# Altium project thymio2-main.PrjPCB (part 2 of 2)

## Sheet LEDs.SchDoc: Thymio2
size A3; Engineer: Michael Bonani; Organization: Original design LSRO-STI-EPFL; Address1: Association Mobsya; Address2: Michael Bonani; Address3: Ch. Closel 3; Address4: CH-1020 Renens; DocumentNumber: 6; Revision: 2.3; SheetNumber: 6; SheetTotal: 9; Title2: PCB principal
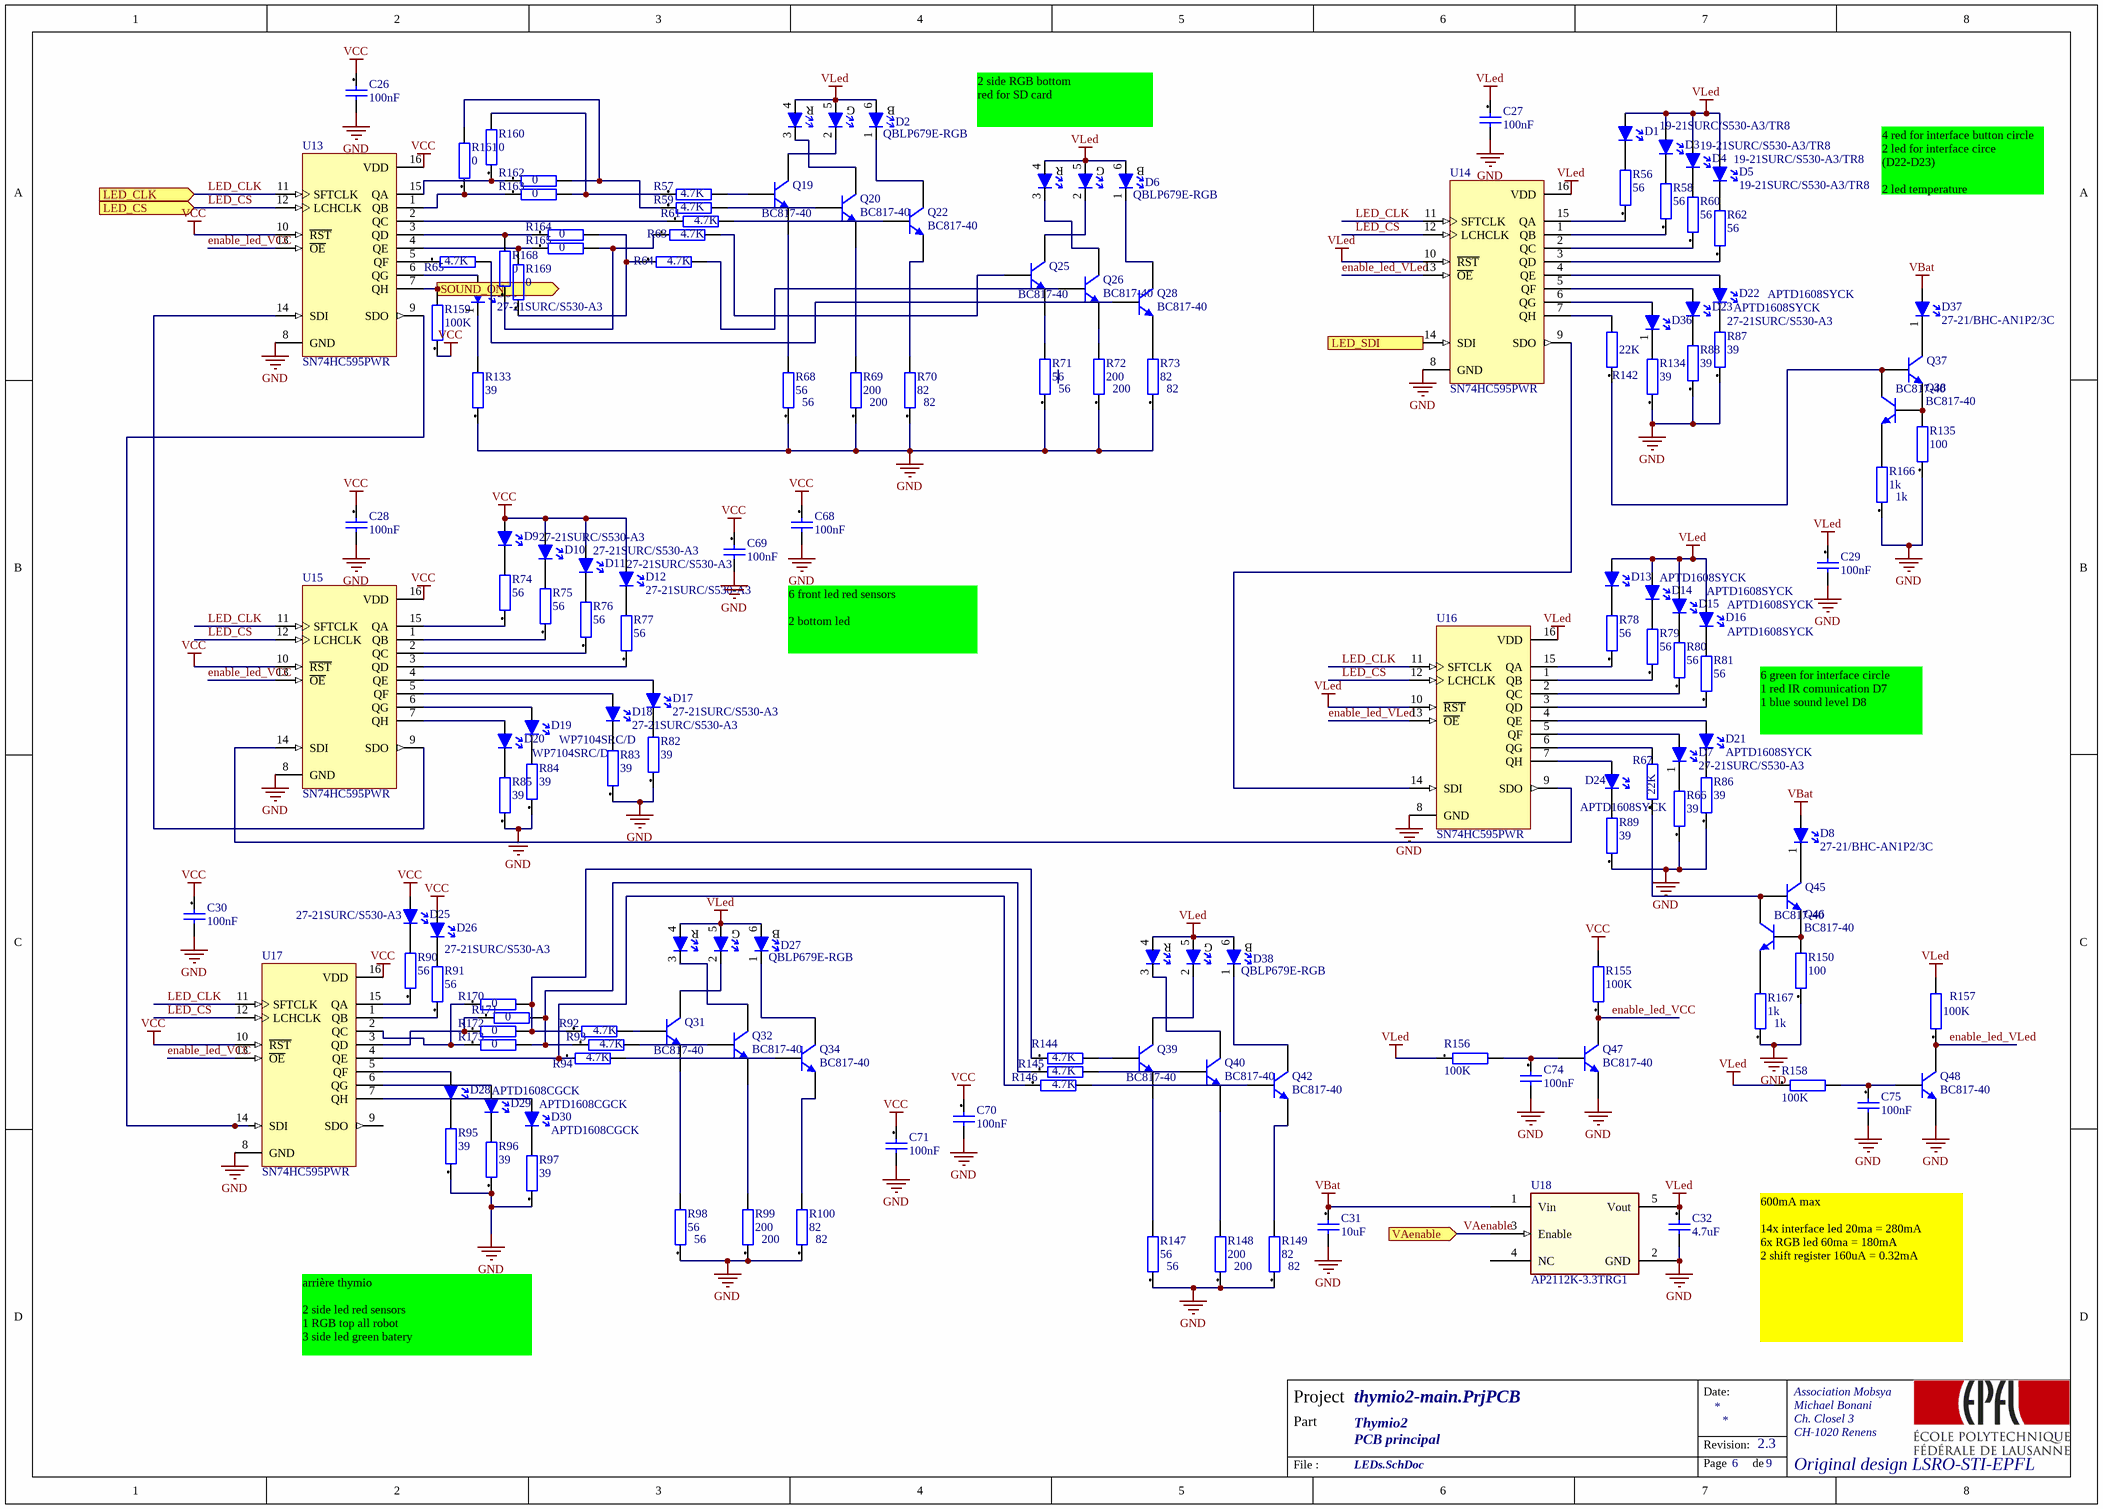
[diagram p5: LEDs.SchDoc]

### Parts
C26  100nF  [CAPC1005X05N]
C27  100nF  [CAPC1005X05N]
C28  100nF  [CAPC1005X05N]
C29  100nF  [CAPC1005X05N]
C30  100nF  [CAPC1005X05N]
C31  10uF  [CAPC1005X05N]
C32  4.7uF  [CAPC1005X05N]
C68  100nF  [CAPC1005X05N]
C69  100nF  [CAPC1005X05N]
C70  100nF  [CAPC1005X05N]
C71  100nF  [CAPC1005X05N]
C74  100nF  [CAPC1005X05N]
C75  100nF  [CAPC1005X05N]
D1  19-21SURC/S530-A3/TR8  [DIOC1608X08N]
D2  QBLP679E-RGB  [QBLP679E-RGB]
D3  19-21SURC/S530-A3/TR8  [DIOC1608X08N]
D4  19-21SURC/S530-A3/TR8  [DIOC1608X08N]
D5  19-21SURC/S530-A3/TR8  [DIOC1608X08N]
D6  QBLP679E-RGB  [QBLP679E-RGB]
D7  27-21SURC/S530-A3  [27-21 Everlight]
D8  27-21/BHC-AN1P2/3C  [27-21 Everlight Blue]
D9  27-21SURC/S530-A3  [27-21 Everlight]
D10  27-21SURC/S530-A3  [27-21 Everlight]
D11  27-21SURC/S530-A3  [27-21 Everlight]
D12  27-21SURC/S530-A3  [27-21 Everlight]
D13  APTD1608SYCK  [DIOC1608X08N]
D14  APTD1608SYCK  [DIOC1608X08N]
D15  APTD1608SYCK  [DIOC1608X08N]
D16  APTD1608SYCK  [DIOC1608X08N]
D17  27-21SURC/S530-A3  [27-21 Everlight]
D18  27-21SURC/S530-A3  [27-21 Everlight]
D19  WP7104SRC/D  [Led_TH_3mm_20mm]
D20  WP7104SRC/D  [Led_TH_3mm_20mm]
D21  APTD1608SYCK  [DIOC1608X08N]
D22  APTD1608SYCK  [DIOC1608X08N]
D23  APTD1608SYCK  [DIOC1608X08N]
D24  APTD1608SYCK  [DIOC1608X08N]
D25  27-21SURC/S530-A3  [27-21 Everlight]
D26  27-21SURC/S530-A3  [27-21 Everlight]
D27  QBLP679E-RGB  [QBLP679E-RGB]
D28  APTD1608CGCK  [DIOC1608X08N]
D29  APTD1608CGCK  [DIOC1608X08N]
D30  APTD1608CGCK  [DIOC1608X08N]
D35  27-21SURC/S530-A3  [27-21 Everlight]
D36  27-21SURC/S530-A3  [27-21 Everlight]
D37  27-21/BHC-AN1P2/3C  [27-21 Everlight Blue]
D38  QBLP679E-RGB  [QBLP679E-RGB]
Q19  BC817-40  [SOT23_N]
Q20  BC817-40  [SOT23_N]
Q22  BC817-40  [SOT23_N]
Q25  BC817-40  [SOT23_N]
Q26  BC817-40  [SOT23_N]
Q28  BC817-40  [SOT23_N]
Q31  BC817-40  [SOT23_N]
Q32  BC817-40  [SOT23_N]
Q34  BC817-40  [SOT23_N]
Q37  BC817-40  [SOT23_N]
Q38  BC817-40  [SOT23_N]
Q39  BC817-40  [SOT23_N]
Q40  BC817-40  [SOT23_N]
Q42  BC817-40  [SOT23_N]
Q45  BC817-40  [SOT23_N]
Q46  BC817-40  [SOT23_N]
Q47  BC817-40  [SOT23_N]
Q48  BC817-40  [SOT23_N]
R56  56  [RESC1005X04N]
R57  4.7K  [RESC1005X04N]
R58  56  [RESC1005X04N]
R59  4.7K  [RESC1005X04N]
R60  56  [RESC1005X04N]
R61  4.7K  [RESC1005X04N]
R62  56  [RESC1005X04N]
R63  4.7K  [RESC1005X04N]
R64  4.7K  [RESC1005X04N]
R65  4.7K  [RESC1005X04N]
R66  39  [RESC1005X04N]
R67  22K  [RESC1005X04N]
R68  56  [RESC1005X04N]
R69  200  [RESC1005X04N]
R70  82  [RESC1005X04N]
R71  56  [RESC1005X04N]
R72  200  [RESC1005X04N]
R73  82  [RESC1005X04N]
R74  56  [RESC1005X04N]
R75  56  [RESC1005X04N]
R76  56  [RESC1005X04N]
R77  56  [RESC1005X04N]
R78  56  [RESC1005X04N]
R79  56  [RESC1005X04N]
R80  56  [RESC1005X04N]
R81  56  [RESC1005X04N]
R82  39  [RESC1005X04N]
R83  39  [RESC1005X04N]
R84  39  [RESC1005X04N]
R85  39  [RESC1005X04N]
R86  39  [RESC1005X04N]
R87  39  [RESC1005X04N]
R88  39  [RESC1005X04N]
R89  39  [RESC1005X04N]
R90  56  [RESC1005X04N]
R91  56  [RESC1005X04N]
R92  4.7K  [RESC1005X04N]
R93  4.7K  [RESC1005X04N]
R94  4.7K  [RESC1005X04N]
R95  39  [RESC1005X04N]
R96  39  [RESC1005X04N]
R97  39  [RESC1005X04N]
R98  56  [RESC1005X04N]
R99  200  [RESC1005X04N]
R100  82  [RESC1005X04N]
R133  39  [RESC1005X04N]
R134  39  [RESC1005X04N]
R135  100  [RESC1005X04N]
R142  22K  [RESC1005X04N]
R144  4.7K  [RESC1005X04N]
R145  4.7K  [RESC1005X04N]
R146  4.7K  [RESC1005X04N]
R147  56  [RESC1005X04N]
R148  200  [RESC1005X04N]
R149  82  [RESC1005X04N]
R150  100  [RESC1005X04N]
R155  100K  [RESC1005X04N]
R156  100K  [RESC1005X04N]
R157  100K  [RESC1005X04N]
R158  100K  [RESC1005X04N]
R159  100K  [RESC1005X04N]
R160  0  [RESC1005X04N]
R161  0  [RESC1005X04N]
R162  0  [RESC1005X04N]
R163  0  [RESC1005X04N]
R164  0  [RESC1005X04N]
R165  0  [RESC1005X04N]
R166  1k  [RESC1005X04N]
R167  1k  [RESC1005X04N]
R168  0  [RESC1005X04N]
R169  0  [RESC1005X04N]
R170  0  [RESC1005X04N]
R171  0  [RESC1005X04N]
R172  0  [RESC1005X04N]
R173  0  [RESC1005X04N]
U13  SN74HC595PWR  [948F-01_N]
U14  SN74HC595PWR  [948F-01_N]
U15  SN74HC595PWR  [948F-01_N]
U16  SN74HC595PWR  [948F-01_N]
U17  SN74HC595PWR  [948F-01_N]
U18  AP2112K-3.3TRG1  [SOT95P285X100-5N]

### Ports
LED_CLK (in), LED_CS (in), LED_SDI (in), SOUND_ON (out), VAenable (in)

### Nets
GND: C26.2 C27.2 C28.2 C29.2 C30.2 C31.2 C32.2 C68.2 C69.2 C70.2 C71.2 C74.2 C75.2 Q47.2(E) Q48.2(E) R66.1 R68.1 R69.1 R70.1 R71.1 R72.1 R73.1 R82.1 R83.1 R84.1 R85.1 R86.1 R87.1 R88.1 R89.1 R95.1 R96.1 R97.1 R98.1 R99.1 R100.1 R133.1 R134.1 R135.1 R147.1 R148.1 R149.1 R150.1 R166.1 R167.1 U13.8(GND) U14.8(GND) U15.8(GND) U16.8(GND) U17.8(GND) U18.2(GND)
VBat: C31.1 D8.2(A) D37.2(A) U18.1(Vin)
VCC: C26.1 C28.1 C30.1 C68.1 C69.1 C70.1 C71.1 D9.2(A) D10.2(A) D11.2(A) D12.2(A) D25.2(A) D26.2(A) R155.2 R159.1 U13.10(~{RST}) U13.16(VDD) U15.10(~{RST}) U15.16(VDD) U17.10(~{RST}) U17.16(VDD)
VLed: C27.1 C29.1 C32.1 D1.2(A) D2.4(Ar) D2.5(Ag) D2.6(Ab) D3.2(A) D4.2(A) D5.2(A) D6.4(Ar) D6.5(Ag) D6.6(Ab) D13.2(A) D14.2(A) D15.2(A) D16.2(A) D27.4(Ar) D27.5(Ag) D27.6(Ab) D38.4(Ar) D38.5(Ag) D38.6(Ab) R156.1 R157.2 R158.1 U14.10(~{RST}) U14.16(VDD) U16.10(~{RST}) U16.16(VDD) U18.5(Vout)
enable_led_VCC: Q47.3(C) R155.1 U13.13(~{OE}) U15.13(~{OE}) U17.13(~{OE})
enable_led_VLed: Q48.3(C) R157.1 U14.13(~{OE}) U16.13(~{OE})
LED_CLK: U13.11(SFTCLK) U14.11(SFTCLK) U15.11(SFTCLK) U16.11(SFTCLK) U17.11(SFTCLK) ; port LED_CLK
LED_CS: U13.12(LCHCLK) U14.12(LCHCLK) U15.12(LCHCLK) U16.12(LCHCLK) U17.12(LCHCLK) ; port LED_CS
LED_SDI: U14.14(SDI) ; port LED_SDI
SOUND_ON: R159.2 U13.7(QH) ; port SOUND_ON
VAenable: U18.3(Enable) ; port VAenable
NetC74_1: C74.1 Q47.1(B) R156.2
NetC75_1: C75.1 Q48.1(B) R158.2
NetD1_1: D1.1(K) R56.2
NetD2_1: D2.1(Kb) Q22.3(C)
NetD2_2: D2.2(Kg) Q19.3(C)
NetD2_3: D2.3(Kr) Q20.3(C)
NetD3_1: D3.1(K) R58.2
NetD4_1: D4.1(K) R60.2
NetD5_1: D5.1(K) R62.2
NetD6_1: D6.1(Kb) Q28.3(C)
NetD6_2: D6.2(Kg) Q25.3(C)
NetD6_3: D6.3(Kr) Q26.3(C)
NetD7_1: D7.1(K) R66.2
NetD7_2: D7.2(A) U16.5(QF)
NetD8_1: D8.1(K) Q45.3(C)
NetD9_1: D9.1(K) R74.2
NetD10_1: D10.1(K) R75.2
NetD11_1: D11.1(K) R76.2
NetD12_1: D12.1(K) R77.2
NetD13_1: D13.1(K) R78.2
NetD14_1: D14.1(K) R79.2
NetD15_1: D15.1(K) R80.2
NetD16_1: D16.1(K) R81.2
NetD17_1: D17.1(K) R82.2
NetD17_2: D17.2(A) U15.4(QE)
NetD18_1: D18.1(K) R83.2
NetD18_2: D18.2(A) U15.5(QF)
NetD19_1: D19.1(K) R84.2
NetD19_2: D19.2(A) U15.6(QG)
NetD20_1: D20.1(K) R85.2
NetD20_2: D20.2(A) U15.7(QH)
NetD21_1: D21.1(K) R86.2
NetD21_2: D21.2(A) U16.4(QE)
NetD22_1: D22.1(K) R87.2
NetD22_2: D22.2(A) U14.4(QE)
NetD23_1: D23.1(K) R88.2
NetD23_2: D23.2(A) U14.5(QF)
NetD24_1: D24.1(K) R89.2
NetD24_2: D24.2(A) U16.7(QH)
NetD25_1: D25.1(K) R90.2
NetD26_1: D26.1(K) R91.2
NetD27_1: D27.1(Kb) Q34.3(C)
NetD27_2: D27.2(Kg) Q31.3(C)
NetD27_3: D27.3(Kr) Q32.3(C)
NetD28_1: D28.1(K) R95.2
NetD28_2: D28.2(A) U17.5(QF)
NetD29_1: D29.1(K) R96.2
NetD29_2: D29.2(A) U17.6(QG)
NetD30_1: D30.1(K) R97.2
NetD30_2: D30.2(A) U17.7(QH)
NetD35_1: D35.1(K) R133.2
NetD35_2: D35.2(A) U13.6(QG)
NetD36_1: D36.1(K) R134.2
NetD36_2: D36.2(A) U14.6(QG)
NetD37_1: D37.1(K) Q37.3(C)
NetD38_1: D38.1(Kb) Q42.3(C)
NetD38_2: D38.2(Kg) Q39.3(C)
NetD38_3: D38.3(Kr) Q40.3(C)
NetQ19_1: Q19.1(B) R57.2
NetQ19_2: Q19.2(E) R68.2
NetQ20_1: Q20.1(B) R59.2
NetQ20_2: Q20.2(E) R69.2
NetQ22_1: Q22.1(B) R61.2
NetQ22_2: Q22.2(E) R70.2
NetQ25_1: Q25.1(B) R63.2
NetQ25_2: Q25.2(E) R71.2
NetQ26_1: Q26.1(B) R64.2
NetQ26_2: Q26.2(E) R72.2
NetQ28_1: Q28.1(B) R65.2
NetQ28_2: Q28.2(E) R73.2
NetQ31_1: Q31.1(B) R92.2
NetQ31_2: Q31.2(E) R98.2
NetQ32_1: Q32.1(B) R93.2
NetQ32_2: Q32.2(E) R99.2
NetQ34_1: Q34.1(B) R94.2
NetQ34_2: Q34.2(E) R100.2
NetQ37_1: Q37.1(B) Q38.3(C) R142.1
NetQ37_2: Q37.2(E) Q38.1(B) R135.2
NetQ38_2: Q38.2(E) R166.2
NetQ39_1: Q39.1(B) R144.2
NetQ39_2: Q39.2(E) R147.2
NetQ40_1: Q40.1(B) R145.2
NetQ40_2: Q40.2(E) R148.2
NetQ42_1: Q42.1(B) R146.2
NetQ42_2: Q42.2(E) R149.2
NetQ45_1: Q45.1(B) Q46.3(C) R67.1
NetQ45_2: Q45.2(E) Q46.1(B) R150.2
NetQ46_2: Q46.2(E) R167.2
NetR56_1: R56.1 U14.15(QA)
NetR57_1: R57.1 R160.2 R163.2
NetR58_1: R58.1 U14.1(QB)
NetR59_1: R59.1 R161.2 R162.2
NetR60_1: R60.1 U14.2(QC)
NetR61_1: R61.1 U13.2(QC)
NetR62_1: R62.1 U14.3(QD)
NetR63_1: R63.1 R165.2 R168.1
NetR64_1: R64.1 R164.2 R169.1
NetR65_1: R65.1 U13.5(QF)
NetR67_2: R67.2 U16.6(QG)
NetR74_1: R74.1 U15.15(QA)
NetR75_1: R75.1 U15.1(QB)
NetR76_1: R76.1 U15.2(QC)
NetR77_1: R77.1 U15.3(QD)
NetR78_1: R78.1 U16.15(QA)
NetR79_1: R79.1 U16.1(QB)
NetR80_1: R80.1 U16.2(QC)
NetR81_1: R81.1 U16.3(QD)
NetR90_1: R90.1 U17.15(QA)
NetR91_1: R91.1 U17.1(QB)
NetR92_1: R92.1 R144.1 R170.2 R172.2
NetR93_1: R93.1 R145.1 R171.2 R173.2
NetR94_1: R94.1 R146.1 U17.4(QE)
NetR142_2: R142.2 U14.7(QH)
NetR160_1: R160.1 R162.1 U13.15(QA)
NetR161_1: R161.1 R163.1 U13.1(QB)
NetR164_1: R164.1 R168.2 U13.3(QD)
NetR165_1: R165.1 R169.2 U13.4(QE)
NetR170_1: R170.1 R173.1 U17.2(QC)
NetR171_1: R171.1 R172.1 U17.3(QD)
NetU13_9: U13.9(SDO) U17.14(SDI)
NetU13_14: U13.14(SDI) U15.9(SDO)
NetU14_9: U14.9(SDO) U16.14(SDI)
NetU15_14: U15.14(SDI) U16.9(SDO)

Not connected (* = marked no-connect by the designer): U17 9(SDO); U18 4(NC)

### Notes on the sheet
- (near D6) 2 side RGB bottom
  red for SD card
- 4 red for interface button circle
  2 led for interface circe (D22-D23)
  2 led temperature
- 6 front led red sensors
  2 bottom led
- 6 green for interface circle
  1 red IR comunication D7
  1 blue sound level D8
- arrière thymio
  2 side led red sensors
  1 RGB top all robot
  3 side led green batery
- 600mA max
  14x interface led 20ma = 280mA
  6x RGB led 60ma = 180mA
  2 shift register 160uA = 0.32mA
- Date:
- Project
- Part
- Revision:
- File :
- Page
- de
- (in symbol LED RGB SMD 2) R; G; B

### Library data of the parts
C26 C28 C30 C68-C71 C74 C75 = 100nF[[/\]]0603[[/\]]1: as C5 on sheet IR-sensors; Size: 0603; Footprint Acort: 0603_G; Supplier: Farnell; Supplier Nr: 1288255; ComponentLink2Description: Farnell link; ComponentLink2URL: http://ch.farnell.com/jsp/displayProduct.jsp?sku=1288255; Price_1: 0.046; Price_2: 0.04; Price_3: 0.037; Price_4: 0.036; ROHS: True; DateLastUpdate: 2007-12-03 / 14:22:31
C27 C29 = 100nF[[/\]]0603[[/\]]1: Capacitor; Manufacturer: Kemet; Manufacturer Nr: C0603C104K5RAC; Preference: 1; Tolerance +: +10; Tolerance -: -10; Dielectric: X7R; Voltage: 50; MaxTemperature: +125; MinTemperature: -55; Quant_1: 10; Quant_2: 100; Quant_3: 1000; Quant_4: 4000; Currentie: CHF; LayerSch: Top; Size: 0603; Footprint Acort: 0603_G; Supplier: Farnell; Supplier Nr: 1288255; ComponentLink2Description: Farnell link; ComponentLink2URL: http://ch.farnell.com/jsp/displayProduct.jsp?sku=1288255; Price_1: 0.046; Price_2: 0.04; Price_3: 0.037; Price_4: 0.036; ROHS: True; DateLastUpdate: 2007-12-03 / 14:22:31
C31 C32 = 4.7uF[[/\]]0603[[/\]]1: as C44 on sheet USB-power; Size: 0603; Footprint Acort: 0603_G; Supplier: Farnell; Supplier Nr: 9227784; ComponentLink2Description: Farnell link; ComponentLink2URL: http://ch.farnell.com/jsp/displayProduct.jsp?sku=9227784; Price_1: 0.33; Price_2: 0.298; Price_3: 0.278; Price_4: 0.246; ROHS: True; DateLastUpdate: 2007-12-03 / 14:22:57
D1 D3-D5 = LED: SMD Red 0603 2V@20ma 56 mcd; VerifiedComment: ToDo; LayerSch: Top
D2 D6 D27 D38 = LED RGB SMD 2: =Value: HBMGFRT825; VerifiedComment: ToDo; LayerSch: Top
D7 D36 = LED: SMD Red led right angle mount 2V@20ma 57mcd; VerifiedComment: ToDo; LayerSch: Top
D8 D37 = LED: SMD Blue led right angle mount 3.3V@20ma 28mcd; VerifiedComment: ToDo; LayerSch: Top
D9-D12 D17 D18 D25 D26 D35 = LED: SMD Red led right angle mount 2V@20ma 57mcd; VerifiedComment: ToDo
D13-D16 D21-D24 = LED: LED standard - CMS Helios SMD Yellow 590nm 480mcd; VerifiedComment: ToDo; LayerSch: Top
D19 D20 = LED: Red led 2V@20ma 57mcd; VerifiedComment: ToDo
D28-D30 = LED: LED standard - CMS Helios SMD Green 570nm 230mcd; VerifiedComment: ToDo; LayerSch: Top
Q19 Q20 Q22 Q25 Q26 Q28 = BC817-40: NPN General-purpose Transistor; Published: 17-Sep-2003; LatestRevisionDate: 12-Dec-2006; LatestRevisionNote: IPC-7351 Footprint Added.; DatasheetVersion: Jun-1999; PackageVersion: May-1999; PackageReference: SOT23; Publisher: Altium Limited; PackageDescription: 3-Pin SOT-23 Package 0.95 mm Pitch, 2.3 mm Lead Span; ComponentLink1Description: Manufacturer Link; ComponentLink1URL: http://www.semiconductors.philips.com/; ComponentLink2Description: Datasheet; ComponentLink2URL: http://www.semiconductors.philips.com/acrobat/datasheets/BC817_BC817W_BC337_5.pdf
Q31 Q32 Q34 Q37-Q40 Q42 Q45-Q48 = BC817-40: NPN General-purpose Transistor; LayerSch: Top; Published: 17-Sep-2003; LatestRevisionDate: 12-Dec-2006; LatestRevisionNote: IPC-7351 Footprint Added.; DatasheetVersion: Jun-1999; PackageVersion: May-1999; PackageReference: SOT23; Publisher: Altium Limited; PackageDescription: 3-Pin SOT-23 Package 0.95 mm Pitch, 2.3 mm Lead Span; ComponentLink1Description: Manufacturer Link; ComponentLink1URL: http://www.semiconductors.philips.com/; ComponentLink2Description: Datasheet; ComponentLink2URL: http://www.semiconductors.philips.com/acrobat/datasheets/BC817_BC817W_BC337_5.pdf
R56 R58 R60 R62 R66 R78-R81 R86-R89 R134 = 68K[[/\]]0603[[/\]]1: Resistor; Manufacturer: Vishay; Manufacturer Nr: D11CRCW06030B6802F; Tolerance: +/-1; Preference: 1; Power: 0.1; Voltage: 75; Current: 1.5; ppm/K: +/-100; Quant_1: 10; Quant_2: 100; Quant_3: 500; Currentie: CHF; LayerSch: Top; Size: 0603; Footprint Acort: 0603; Supplier: Distrelec; Supplier Nr: 715632; ComponentLink2Description: Distrelec link; ComponentLink2URL: http://www.distrelec.com/ishopWebFront/search/luceneSearch.do?dispatch=find&showImage=on&artnrPhrase=715632; ROHS: True; Price_1: 0.0538; Price_2: 0.0323; Price_3: 0.0204; DateLastUpdate: 2007-12-03 / 16:30:21
R57 R59 R61 R63-R65 = 4.7K[[/\]]0603[[/\]]1: Resistor; Manufacturer: Vishay; Manufacturer Nr: D11CRCW06030B4701F; Tolerance: +/-1; Preference: 1; Power: 0.1; Voltage: 75; Current: 1.5; ppm/K: +/-100; Quant_1: 10; Quant_2: 100; Quant_3: 500; Currentie: CHF; Size: 0603; Footprint Acort: 0603; Supplier: Distrelec; Supplier Nr: 715604; ComponentLink2Description: Distrelec link; ComponentLink2URL: http://www.distrelec.com/ishopWebFront/search/luceneSearch.do?dispatch=find&showImage=on&artnrPhrase=715604; ROHS: True; Price_1: 0.0538; Price_2: 0.0323; Price_3: 0.0204; DateLastUpdate: 2007-12-03 / 16:30:20
R67 R92-R94 R142 R144-R146 R155-R165 R168-R173 = 4.7K[[/\]]0603[[/\]]1: Resistor; Manufacturer: Vishay; Manufacturer Nr: D11CRCW06030B4701F; Tolerance: +/-1; Preference: 1; Power: 0.1; Voltage: 75; Current: 1.5; ppm/K: +/-100; Quant_1: 10; Quant_2: 100; Quant_3: 500; Currentie: CHF; LayerSch: Top; Size: 0603; Footprint Acort: 0603; Supplier: Distrelec; Supplier Nr: 715604; ComponentLink2Description: Distrelec link; ComponentLink2URL: http://www.distrelec.com/ishopWebFront/search/luceneSearch.do?dispatch=find&showImage=on&artnrPhrase=715604; ROHS: True; Price_1: 0.0538; Price_2: 0.0323; Price_3: 0.0204; DateLastUpdate: 2007-12-03 / 16:30:20
R68-R73 = RES
  R68 R71: Value: 56
  R69 R72: Value: 200
  R70 R73: Value: 82
R74-R77 R82-R85 R90 R91 R95-R97 R133 = 68K[[/\]]0603[[/\]]1: Resistor; Manufacturer: Vishay; Manufacturer Nr: D11CRCW06030B6802F; Tolerance: +/-1; Preference: 1; Power: 0.1; Voltage: 75; Current: 1.5; ppm/K: +/-100; Quant_1: 10; Quant_2: 100; Quant_3: 500; Currentie: CHF; Size: 0603; Footprint Acort: 0603; Supplier: Distrelec; Supplier Nr: 715632; ComponentLink2Description: Distrelec link; ComponentLink2URL: http://www.distrelec.com/ishopWebFront/search/luceneSearch.do?dispatch=find&showImage=on&artnrPhrase=715632; ROHS: True; Price_1: 0.0538; Price_2: 0.0323; Price_3: 0.0204; DateLastUpdate: 2007-12-03 / 16:30:21
R98-R100 R147-R149 = RES: LayerSch: Top
  R98 R147: Value: 56
  R99 R148: Value: 200
  R100 R149: Value: 82
R135 R150 = 68K[[/\]]0603[[/\]]1: Resistor; Manufacturer: Vishay; Manufacturer Nr: D11CRCW06030B6802F; Tolerance: +/-1; Preference: 1; Power: 0.1; Voltage: 75; Current: 1.5; ppm/K: +/-100; Quant_1: 10; Quant_3: 500; Currentie: CHF; LayerSch: Top; Size: 0603; Footprint Acort: 0603; Supplier: Distrelec; Supplier Nr: 715632; ComponentLink2Description: Distrelec link; ComponentLink2URL: http://www.distrelec.com/ishopWebFront/search/luceneSearch.do?dispatch=find&showImage=on&artnrPhrase=715632; ROHS: True; Price_1: 0.0538; Quant_2: 100; Price_2: 0.0323; Price_3: 0.0204; DateLastUpdate: 2007-12-03 / 16:30:21
R166 R167 = RES: 120; Value: 1k
U13 U15 U17 = MC74HC595ADTR2: 8-Bit Serial-Input/Serial or Prallel-Output Shift Register with Latched 3-State Outputs; Published: 15-Apr-2002; LatestRevisionDate: 12-Dec-2006; LatestRevisionNote: IPC-7351 Footprint Added.; DatasheetVersion: Mar-2000; PackageVersion: Feb-2000; PackageReference: 948F-01; Publisher: Altium Limited; PackageDescription: 16-Pin Thin Small Outline Package 0.65 mm Pitch; ComponentLink1Description: Manufacturer Link; ComponentLink1URL: http://www.onsemi.com/; ComponentLink2Description: Datasheet; ComponentLink2URL: http://www.onsemi.com/pub/Collateral/MC74HC595A-D.PDF
U14 U16 = MC74HC595ADTR2: 8-Bit Serial-Input/Serial or Prallel-Output Shift Register with Latched 3-State Outputs; LayerSch: Top; Published: 15-Apr-2002; LatestRevisionDate: 12-Dec-2006; LatestRevisionNote: IPC-7351 Footprint Added.; DatasheetVersion: Mar-2000; PackageVersion: Feb-2000; PackageReference: 948F-01; Publisher: Altium Limited; PackageDescription: 16-Pin Thin Small Outline Package 0.65 mm Pitch; ComponentLink1Description: Manufacturer Link; ComponentLink1URL: http://www.onsemi.com/; ComponentLink2Description: Datasheet; ComponentLink2URL: http://www.onsemi.com/pub/Collateral/MC74HC595A-D.PDF
U18 = AP7331: as U22 on sheet USB-power

## Sheet motor.SchDoc: Thymio2
size A4; Organization: Original design LSRO-STI-EPFL; Address1: Association Mobsya; Address2: Michael Bonani; Address3: Ch. Closel 3; Address4: CH-1020 Renens; DocumentNumber: 7; Revision: 2.3; SheetNumber: 7; SheetTotal: 9; Engineer: Michael Bonani; Title2: PCB principal; ProjectName: Name of the project
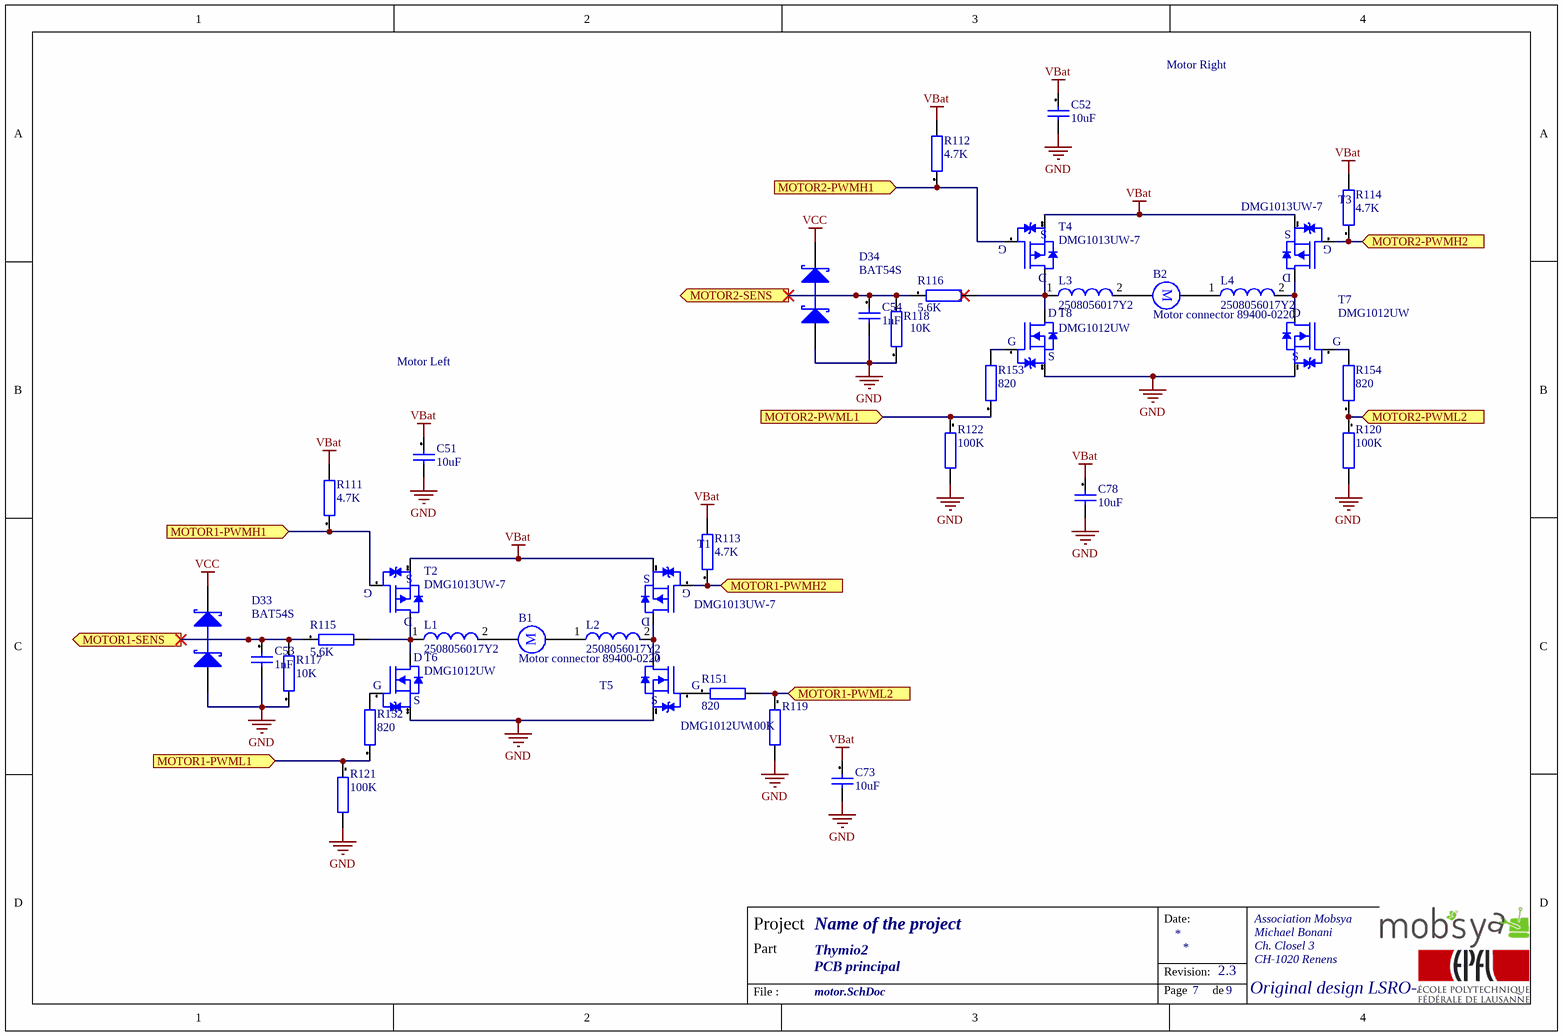
[diagram p6: motor.SchDoc]

### Parts
B1  Motor connector 89400-0220  [BAT-2]
B2  Motor connector 89400-0220  [BAT-2]
C51  10uF  [CAPC1005X05N]
C52  10uF  [CAPC1005X05N]
C53  1nF  [CAPC1005X05N]
C54  1nF  [CAPC1005X05N]
C73  10uF  [CAPC1005X05N]
C78  10uF  [CAPC1005X05N]
D33  BAT54S  [SOT23_N]
D34  BAT54S  [SOT23_N]
L1  2508056017Y2  [INDC2012X11L]
L2  2508056017Y2  [INDC2012X11L]
L3  2508056017Y2  [INDC2012X11L]
L4  2508056017Y2  [INDC2012X11L]
R111  4.7K  [RESC1005X04N]
R112  4.7K  [RESC1005X04N]
R113  4.7K  [RESC1005X04N]
R114  4.7K  [RESC1005X04N]
R115  5.6K  [RESC1005X04N]
R116  5.6K  [RESC1005X04N]
R117  10K  [RESC1005X04N]
R118  10K  [RESC1005X04N]
R119  100K  [RESC1005X04N]
R120  100K  [RESC1005X04N]
R121  100K  [RESC1005X04N]
R122  100K  [RESC1005X04N]
R151  820  [RESC1005X04N]
R152  820  [RESC1005X04N]
R153  820  [RESC1005X04N]
R154  820  [RESC1005X04N]
T1  DMG1013UW-7  [SOT65P210X100-3N]
T2  DMG1013UW-7  [SOT65P210X100-3N]
T3  DMG1013UW-7  [SOT65P210X100-3N]
T4  DMG1013UW-7  [SOT65P210X100-3N]
T5  DMG1012UW  [SOT65P210X100-3N]
T6  DMG1012UW  [SOT65P210X100-3N]
T7  DMG1012UW  [SOT65P210X100-3N]
T8  DMG1012UW  [SOT65P210X100-3N]

### Ports
MOTOR1-PWMH1 (in), MOTOR1-PWMH2 (in), MOTOR1-PWML1 (in), MOTOR1-PWML2 (in), MOTOR1-SENS (out), MOTOR2-PWMH1 (in), MOTOR2-PWMH2 (in), MOTOR2-PWML1 (in), MOTOR2-PWML2 (in), MOTOR2-SENS (out)

### Nets
GND: C51.2 C52.2 C53.2 C54.2 C73.2 C78.2 D33.1(A) D34.1(A) R117.1 R118.1 R119.2 R120.2 R121.2 R122.2 T5.2(S) T6.2(S) T7.2(S) T8.2(S)
VBat: C51.1 C52.1 C73.1 C78.1 R111.2 R112.2 R113.2 R114.2 T1.2(S) T2.2(S) T3.2(S) T4.2(S)
VCC: D33.2(K) D34.2(K)
MOTOR1-PWMH1: R111.1 T2.1(G) ; port MOTOR1-PWMH1
MOTOR1-PWMH2: R113.1 T1.1(G) ; port MOTOR1-PWMH2
MOTOR1-PWML1: R121.1 R152.1 ; port MOTOR1-PWML1
MOTOR1-PWML2: R119.1 R151.2 ; port MOTOR1-PWML2
MOTOR1-SENS: C53.1 D33.3(C) R115.1 R117.2 ; port MOTOR1-SENS
MOTOR2-PWMH1: R112.1 T4.1(G) ; port MOTOR2-PWMH1
MOTOR2-PWMH2: R114.1 T3.1(G) ; port MOTOR2-PWMH2
MOTOR2-PWML1: R122.1 R153.1 ; port MOTOR2-PWML1
MOTOR2-PWML2: R120.1 R154.1 ; port MOTOR2-PWML2
MOTOR2-SENS: C54.1 D34.3(C) R116.1 R118.2 ; port MOTOR2-SENS
NetB1_1: B1.1 L1.2
NetB1_2: B1.2 L2.1
NetB2_1: B2.1 L4.1
NetB2_2: B2.2 L3.2
NetL1_1: L1.1 R115.2 T2.3(D) T6.3(D)
NetL2_2: L2.2 T1.3(D) T5.3(D)
NetL3_1: L3.1 R116.2 T4.3(D) T8.3(D)
NetL4_2: L4.2 T3.3(D) T7.3(D)
NetR151_1: R151.1 T5.1(G)
NetR152_2: R152.2 T6.1(G)
NetR153_2: R153.2 T8.1(G)
NetR154_2: R154.2 T7.1(G)

### Notes on the sheet
- Motor Right
- Motor Left
- Date:
- Project
- Part
- Revision:
- File :
- Page
- de
- (in symbol Motor) M

### Library data of the parts
B1 B2 = Motor: Motor, General Kind; LayerSch: Top; Published: 24-Mar-1999; LatestRevisionDate: 17-Jul-2002; LatestRevisionNote: Re-released for DXP Platform.; PackageReference: RB5-10.5; Publisher: Altium Limited
C51 C52 C73 C78 = 10uF[[/\]]0603[[/\]]1: Capacitor; Manufacturer: Taiyo Yuden; Manufacturer Nr: JMK107BJ106MA-T; Preference: 1; Tolerance +: +15; Tolerance -: -15; Dielectric: X5R; Voltage: 6.3; MaxTemperature: +85; MinTemperature: -55; Quant_2: 100; Quant_3: 500; Currentie: CHF; Size: 0603; Footprint Acort: 0603_G; Supplier: Farnell; Supplier Nr: 1463375; ComponentLink2Description: Farnell link; ComponentLink2URL: http://ch.farnell.com/jsp/displayProduct.jsp?sku=1463375; Quant_1: 1; Price_1: 0.768; Price_2: 0.674; Price_3: 0.372; ROHS: True; DateLastUpdate: 2007-12-03 / 14:22:36
C53 C54 = 100nF[[/\]]0603[[/\]]1: as C27 on sheet LEDs; Size: 0603; Footprint Acort: 0603_G; Supplier: Farnell; Supplier Nr: 1288255; ComponentLink2Description: Farnell link; ComponentLink2URL: http://ch.farnell.com/jsp/displayProduct.jsp?sku=1288255; Price_1: 0.046; Price_2: 0.04; Price_3: 0.037; Price_4: 0.036; ROHS: True; DateLastUpdate: 2007-12-03 / 14:22:31
D33 D34 = BAT54S: Schottky Barrier Double Diode; LayerSch: Top; Published: 17-Sep-2003; LatestRevisionDate: 12-Dec-2006; LatestRevisionNote: IPC-7351 Footprint Added.; DatasheetVersion: 4-Mar-2002; PackageVersion: May-1999; PackageReference: SOT23; Publisher: Altium Limited; PackageDescription: 3-Pin SOT-23 Package 0.95 mm Pitch, 2.3 mm Lead Span; ComponentLink1Description: Manufacturer Link; ComponentLink1URL: http://www.semiconductors.philips.com/; ComponentLink2Description: Datasheet; ComponentLink2URL: http://www.semiconductors.philips.com/acrobat/datasheets/BAT54_SERIES_4.pdf
L1-L4 = 74279204: as L5 on sheet microcontroleur; PackageReference: SMD-0805; PackageDescription: Chip Inductor, 2-Leads, Body 2.0 x 1.2 mm; PartNumber: 2508056017Y2; ComponentLink1Description: Fair-Rite; ComponentLink2Description: https://www.mouser.ch/datasheet/2/150/2508056017Y2-472219.pdf
R111-R114 = 4.7K[[/\]]0603[[/\]]1: as R57 on sheet LEDs; Size: 0603; Footprint Acort: 0603; Supplier: Distrelec; Supplier Nr: 715604; ComponentLink2Description: Distrelec link; ComponentLink2URL: http://www.distrelec.com/ishopWebFront/search/luceneSearch.do?dispatch=find&showImage=on&artnrPhrase=715604; ROHS: True; Price_1: 0.0538; Price_2: 0.0323; Price_3: 0.0204; DateLastUpdate: 2007-12-03 / 16:30:20
R115 R116 = 2.2K[[/\]]0603[[/\]]1: Resistor; Manufacturer: Vishay; Manufacturer Nr: D11CRCW06030B2201F; Tolerance: +/-1; Preference: 1; Power: 0.1; Voltage: 75; Current: 1.5; ppm/K: +/-100; Quant_1: 10; Quant_2: 100; Quant_3: 500; Currentie: CHF; LayerSch: Top; Size: 0603; Footprint Acort: 0603; Supplier: Distrelec; Supplier Nr: 715596; ComponentLink2Description: Distrelec link; ComponentLink2URL: http://www.distrelec.com/ishopWebFront/search/luceneSearch.do?dispatch=find&showImage=on&artnrPhrase=715596; ROHS: True; Price_1: 0.085; Price_2: 0.0603; Price_3: 0.0247; DateLastUpdate: 2009-06-10 / 12:36:43
R117 R118 = 8.2K[[/\]]0603[[/\]]2: Resistor; Manufacturer: Multicomp; Manufacturer Nr: MC 0.063W 0603 1% 8K2; Tolerance: +/-1%; Preference: 2; Power: 0.063; Voltage: 50; Current: 1; ppm/K: +/-100; Quant_2: 250; Quant_3: 1000; Quant_4: 5000; Quant_5: 15000; Currentie: CHF; LayerSch: Top; Size: 0603; Footprint Acort: 0603; Supplier: Farnell; Supplier Nr: 9331565; ComponentLink2Description: Farnell link; ComponentLink2URL: http://ch.farnell.com/jsp/displayProduct.jsp?sku=9331565; ROHS: True; Quant_1: 50; Price_1: 0.062; Price_2: 0.049; Price_3: 0.038; Price_4: 0.027; Price_5: 0.021; DateLastUpdate: 2007-11-29 / 09:13:37
R119-R122 = 100K[[/\]]0603[[/\]]1: as R143 on sheet microcontroleur; Size: 0603; Footprint Acort: 0603; ComponentLink1Description: OnLine datasheet; Supplier: Distrelec; Supplier Nr: 715636; ComponentLink2Description: Distrelec link; ComponentLink2URL: http://www.distrelec.com/ishopWebFront/search/luceneSearch.do?dispatch=find&showImage=on&artnrPhrase=715636; ROHS: True; Price_1: 0.0538; Price_2: 0.0323; Price_3: 0.0204; DateLastUpdate: 2007-12-03 / 16:29:58
R151-R154 = 22K[[/\]]0603[[/\]]1: Resistor; Manufacturer: Vishay; Manufacturer Nr: D11CRCW06030B2202F; Tolerance: +/-1; Preference: 1; Power: 0.1; Voltage: 75; Current: 1.5; ppm/K: +/-100; Quant_1: 10; Quant_2: 100; Quant_3: 500; Currentie: CHF; LayerSch: Top; Size: 0603; Footprint Acort: 0603; Supplier: Distrelec; Supplier Nr: 715620; ComponentLink2Description: Distrelec link; ComponentLink2URL: http://www.distrelec.com/ishopWebFront/search/luceneSearch.do?dispatch=find&showImage=on&artnrPhrase=715620; ROHS: True; Price_1: 0.0538; Price_2: 0.0323; Price_3: 0.0204; DateLastUpdate: 2007-12-03 / 16:30:04
T1-T4 = DMG1013T: Transistor MOSFET 1 x P Pining : 1=G, 2=S, 3=D; VerifiedComment: Ok; VerifiedBy: DBR; VerifiedDate: 20071013
T5-T8 = DMG1012T: Transistor MOSFET 1 x N, Pining : 1=G, 2=S, 3=D; VerifiedComment: Ok; VerifiedBy: DBR; VerifiedDate: 20071013

## Sheet sound.SchDoc: Thymio2
size A4; Organization: Original design LSRO-STI-EPFL; Address1: Association Mobsya; Address2: Michael Bonani; Address3: Ch. Closel 3; Address4: CH-1020 Renens; DocumentNumber: 8; Revision: 2.3; SheetNumber: 8; SheetTotal: 9; Engineer: Michael Bonani; Title2: PCB principal; ProjectName: Name of the project
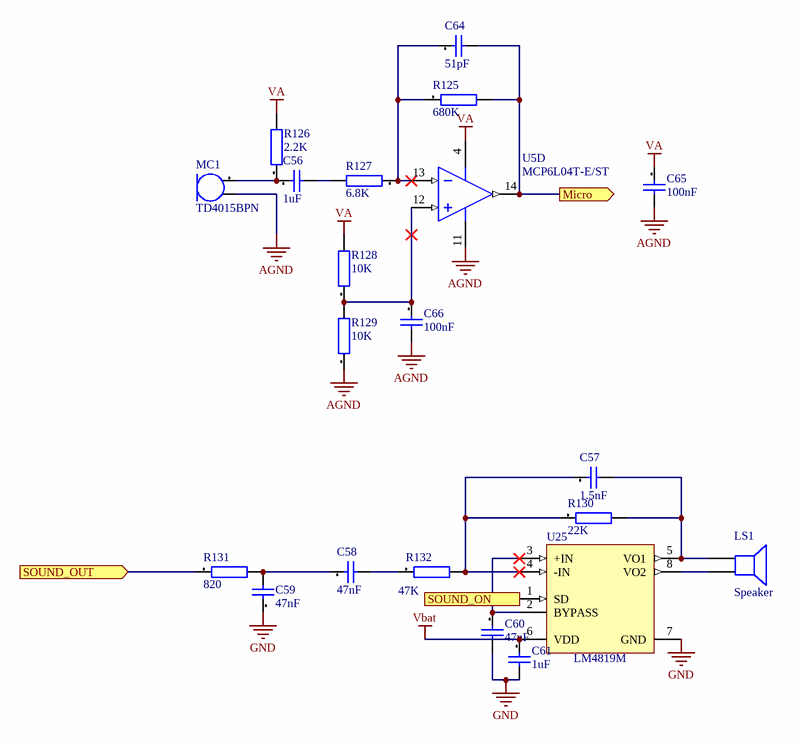
[diagram p7: sound.SchDoc]

### Parts
C56  1uF  [CAPC1005X05N]
C57  1.5nF  [CAPC1005X05N]
C58  47nF  [CAPC1005X05N]
C59  47nF  [CAPC1005X05N]
C60  47nF  [CAPC1005X05N]
C61  1uF  [CAPC1005X05N]
C64  51pF  [CAPC1005X05N]
C65  100nF  [CAPC1005X05N]
C66  100nF  [CAPC1005X05N]
LS1  Speaker  [PIN2]
MC1  TD4015BPN  [MICRO_TD4015BPN]
R125  680K  [RESC1005X04N]
R126  2.2K  [RESC1005X04N]
R127  6.8K  [RESC1005X04N]
R128  10K  [RESC1005X04N]
R129  10K  [RESC1005X04N]
R130  22K  [RESC1005X04N]
R131  820  [RESC1005X04N]
R132  47K  [RESC1005X04N]
U5  MCP6L04T-E/ST  [TSSOP-ST14_N]  (part D of 4)
U25  LM4819M  [M08A_N]

### Ports
Micro (out), SOUND_ON (in), SOUND_OUT (in)

### Nets
AGND: C65.2 C66.2 MC1.2 R129.1 U5.11(VSS)
GND: C59.1 C60.2 C61.2 U25.7(GND)
VA: C65.1 R126.2 R128.2 U5.4(VDD)
VBat: C61.1 U25.6(VDD)
Micro: C64.2 R125.2 U5.14(VOUTD) ; port Micro
SOUND_ON: U25.1(SD) ; port SOUND_ON
SOUND_OUT: R131.1 ; port SOUND_OUT
NetC56_1: C56.1 MC1.1 R126.1
NetC56_2: C56.2 R127.2
NetC57_1: C57.1 R130.1 R132.2 U25.4(-IN)
NetC57_2: C57.2 LS1.2 R130.2 U25.5(VO1)
NetC58_1: C58.1 C59.2 R131.2
NetC58_2: C58.2 R132.1
NetC60_1: C60.1 U25.2(BYPASS) U25.3(+IN)
NetC64_1: C64.1 R125.1 R127.1 U5.13(VIND-)
NetC66_1: C66.1 R128.1 R129.2 U5.12(VIND+)
NetLS1_1: LS1.1 U25.8(VO2)

### Notes on the sheet
- Date:
- Project
- Part
- Revision:
- File :
- Page
- de

### Library data of the parts
C56 = 4.7uF[[/\]]0603[[/\]]1: as C44 on sheet USB-power; Size: 0603; Footprint Acort: 0603_G; Supplier: Farnell; Supplier Nr: 9227784; ComponentLink2Description: Farnell link; ComponentLink2URL: http://ch.farnell.com/jsp/displayProduct.jsp?sku=9227784; Price_1: 0.33; Price_2: 0.298; Price_3: 0.278; Price_4: 0.246; ROHS: True; DateLastUpdate: 2007-12-03 / 14:22:57
C57 C59 C64 = 10nF[[/\]]0603[[/\]]1: Capacitor; Manufacturer: Multicomp; Manufacturer Nr: U0603R103KCT; Preference: 1; Tolerance +: +10; Tolerance -: -10; Dielectric: X7R; Voltage: 50; MaxTemperature: +125; MinTemperature: -55; Quant_1: 10; Quant_2: 100; Quant_3: 1000; Currentie: CHF; LayerSch: Top; Size: 0603; Footprint Acort: 0603_G; Supplier: Farnell; Supplier Nr: 9406182; ComponentLink2Description: Farnell link; ComponentLink2URL: http://ch.farnell.com/jsp/displayProduct.jsp?sku=9406182; Price_1: 0.062; Price_2: 0.041; Price_3: 0.021; ROHS: True; DateLastUpdate: 2007-12-03 / 14:22:34
C58 C60 = 470nF[[/\]]0603[[/\]]1: Capacitor; Manufacturer: Murata; Manufacturer Nr: GRM188R61C474K; Preference: 1; Tolerance +: +10; Tolerance -: -10; Dielectric: X5R; Voltage: 16; MaxTemperature: +85; MinTemperature: -55; Quant_1: 10; Quant_2: 100; Quant_3: 500; Currentie: CHF; LayerSch: Top; Size: 0603; Footprint Acort: 0603_G; Supplier: Distrelec; Supplier Nr: 823494; ComponentLink2Description: Distrelec link; ComponentLink2URL: http://www.distrelec.com/ishopWebFront/search/luceneSearch.do?dispatch=find&showImage=on&artnrPhrase=823494; Price_1: 0.1797; Price_2: 0.1474; Price_3: 0.1162; ROHS: True; DateLastUpdate: 2007-12-03 / 14:23:01
C61 = 1uF[[/\]]0603[[/\]]1: Capacitor; Manufacturer: Murata; Manufacturer Nr: GRM188R61E105K; Preference: 1; Tolerance +: +10; Tolerance -: -10; Dielectric: X5R; Voltage: 25; MaxTemperature: +85; MinTemperature: -55; Quant_1: 10; Quant_2: 100; Quant_3: 500; Currentie: CHF; LayerSch: Top; Size: 0603; Footprint Acort: 0603_G; Supplier: Distrelec; Supplier Nr: 823495; ComponentLink2Description: Distrelec link; ComponentLink2URL: http://www.distrelec.com/ishopWebFront/search/luceneSearch.do?dispatch=find&showImage=on&artnrPhrase=823495; Price_1: 0.1797; Price_2: 0.1474; Price_3: 0.1162; ROHS: True; DateLastUpdate: 2007-12-03 / 14:22:46
C65 C66 = 100nF[[/\]]0603[[/\]]1: as C27 on sheet LEDs; Size: 0603; Footprint Acort: 0603_G; Supplier: Farnell; Supplier Nr: 1288255; ComponentLink2Description: Farnell link; ComponentLink2URL: http://ch.farnell.com/jsp/displayProduct.jsp?sku=1288255; Price_1: 0.046; Price_2: 0.04; Price_3: 0.037; Price_4: 0.036; ROHS: True; DateLastUpdate: 2007-12-03 / 14:22:31
LS1 = Speaker: Loudspeaker; LayerSch: Top; Published: 24-Mar-1999; LatestRevisionDate: 17-Jul-2002; LatestRevisionNote: Re-released for DXP Platform.; PackageReference: PIN2; Publisher: Altium Limited
MC1 = Micro1: Omnidirectional Back Electret Condenser Microphone; LayerSch: Top
R125 = 470K[[/\]]0603[[/\]]1: Resistor; Manufacturer: Vishay; Manufacturer Nr: D11CRCW06030B4703F; Tolerance: +/-1; Preference: 1; Power: 0.1; Voltage: 75; Current: 1.5; ppm/K: +/-100; Quant_1: 10; Quant_2: 100; Quant_3: 500; Currentie: CHF; LayerSch: Top; Size: 0603; Footprint Acort: 0603; Supplier: Distrelec; Supplier Nr: 715652; ComponentLink2Description: Distrelec link; ComponentLink2URL: http://www.distrelec.com/ishopWebFront/search/luceneSearch.do?dispatch=find&showImage=on&artnrPhrase=715652; ROHS: True; Price_1: 0.0538; Price_2: 0.0323; Price_3: 0.0204; DateLastUpdate: 2007-12-03 / 16:30:19
R126 = 2.2K[[/\]]0603[[/\]]1: as R115 on sheet motor; Size: 0603; Footprint Acort: 0603; Supplier: Distrelec; Supplier Nr: 715596; ComponentLink2Description: Distrelec link; ComponentLink2URL: http://www.distrelec.com/ishopWebFront/search/luceneSearch.do?dispatch=find&showImage=on&artnrPhrase=715596; ROHS: True; Price_1: 0.085; Price_2: 0.0603; Price_3: 0.0247; DateLastUpdate: 2009-06-10 / 12:36:43
R127-R129 = 10K[[/\]]0603[[/\]]1: Resistor; Manufacturer: Vishay; Manufacturer Nr: D11CRCW06030B1002F; Tolerance: +/-1; Preference: 1; Power: 0.1; Voltage: 75; Current: 1.5; ppm/K: +/-100; Quant_1: 10; Quant_2: 100; Quant_3: 500; Currentie: CHF; LayerSch: Top; Size: 0603; Footprint Acort: 0603; ComponentLink1Description: OnLine datasheet; Supplier: Distrelec; Supplier Nr: 715612; ComponentLink2Description: Distrelec link; ComponentLink2URL: http://www.distrelec.com/ishopWebFront/search/luceneSearch.do?dispatch=find&showImage=on&artnrPhrase=715612; ROHS: True; Price_1: 0.0538; Price_2: 0.0323; Price_3: 0.0204; DateLastUpdate: 2007-12-03 / 16:29:57
R130-R132 = 22K[[/\]]0603[[/\]]1: as R151 on sheet motor; Size: 0603; Footprint Acort: 0603; Supplier: Distrelec; Supplier Nr: 715620; ComponentLink2Description: Distrelec link; ComponentLink2URL: http://www.distrelec.com/ishopWebFront/search/luceneSearch.do?dispatch=find&showImage=on&artnrPhrase=715620; ROHS: True; Price_1: 0.0538; Price_2: 0.0323; Price_3: 0.0204; DateLastUpdate: 2007-12-03 / 16:30:04
U5 = MCP6L04T-E/ST: 1 MHz, 85 µA Quad Op Amp, 14-Pin TSSOP, Extended Temperature Range, Tape and Reel; LayerSch: Top; FirstPublished: 2-Dec-2009; DatasheetVersion: revA, Mar-2009; PackageVersion: revBB, Aug-2009; PackageReference: TSSOP-ST14; Publisher: Altium Limited; PackageDescription: 14-Lead Plastic Thin Shrink Small Outline (ST) - 4.4mm Body [TSSOP]; Supplier 1: Digi-Key; Supplier Part Number 1: MCP6L04T-E/STTR-ND; Supplier 2: Digi-Key; Supplier Part Number 2: MCP6L04T-E/STDKR-ND; Supplier 3: Digi-Key; Supplier Part Number 3: MCP6L04T-E/STCT-ND; Supplier 4: Newark; Supplier Part Number 4: 08R1815; ComponentLink1Description: Datasheet; ComponentLink1URL: http://ww1.microchip.com/downloads/en/DeviceDoc/22140a.pdf; ComponentLink2Description: Packaging Specification; ComponentLink2URL: http://www.microchip.com/stellent/groups/techpub_sg/documents/packagingspec/en012702.pdf; ComponentLink3Description: Microchip.com Home; ComponentLink3URL: http://www.microchip.com/
U25 = LM4819M: 350mW Audio Power Amplifier with Shutdown Mode; Manufacturer: National Semiconductor; CompType: Audio IC; PackageTopMarking: NSZXTT*LM48*19M; LayerSch: Top; Published: 4-Dec-2008; DatasheetVersion: Apr-2002; PackageVersion: revL, Sep-2006; PackageReference: M08A; Publisher: Altium Limited; PackageDescription: SOIC Narrow, 4.9 x 3.9 x 1.45mm, 8 Lead, 1.27mm Pitch; PartNumber: LM4819M; RoHS: Y; PinCount: 8; DigiKeyPartNumber: LM4819M-ND; Code_JEDEC: MS-012-AA; Code_IPC: SOIC127P600-8; ComponentLink1Description: LM4819 Datasheet; ComponentLink1URL: http://www.national.com/ds/LM/LM4819.pdf; ComponentLink2Description: LM4819 Web Page; ComponentLink2URL: http://www.national.com/pf/LM/LM4819.html; ComponentLink3Description: M08A Package Page; ComponentLink3URL: http://www.national.com/packaging/folders/m08a.html

## Sheet SDcard.SchDoc: Thymio2
size A4; Organization: Original design LSRO-STI-EPFL; Address1: Association Mobsya; Address2: Michael Bonani; Address3: Ch. Closel 3; Address4: CH-1020 Renens; DocumentNumber: 9; Revision: 2.3; SheetNumber: 9; SheetTotal: 9; Engineer: Michael Bonani; Title2: PCB principal; ProjectName: Name of the project
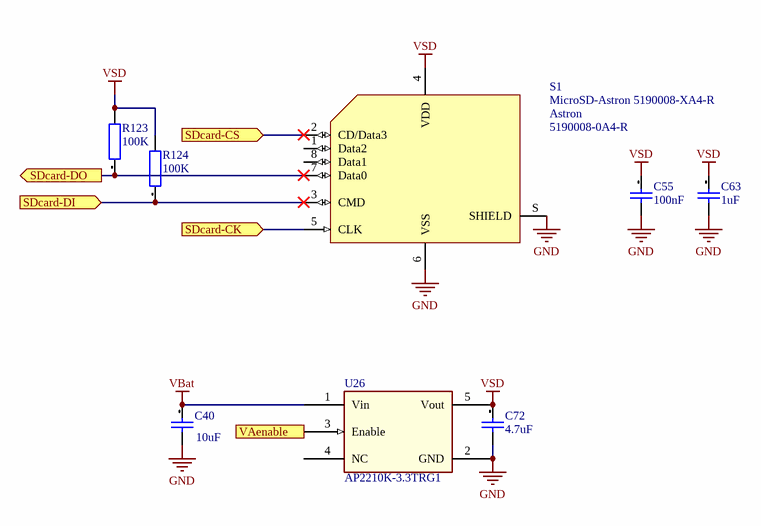
[diagram p8: SDcard.SchDoc]

### Parts
C40  10uF  [CAPC1005X05N]
C55  100nF  [CAPC1005X05N]
C63  1uF  [CAPC1005X05N]
C72  4.7uF  [CAPC1005X05N]
R123  100K  [RESC1005X04N]
R124  100K  [RESC1005X04N]
S1  MicroSD-Astron 5190008-XA4-R  Manufacturer: Astron  MFG Part Number: 5190008-0A4-R  [Astron 5190008-XA4-R]
U26  AP2210K-3.3TRG1  [SOT95P285X100-5N]

### Ports
SDcard-CK (in), SDcard-CS (in), SDcard-DI (in), SDcard-DO (out), VAenable (in)

### Nets
GND: C40.2 C55.2 C63.2 C72.2 S1.6(VSS) S1.S(SHIELD) U26.2(GND)
VBat: C40.1 U26.1(Vin)
VSD: C55.1 C63.1 C72.1 R123.2 R124.2 S1.4(VDD) U26.5(Vout)
SDcard-CK: S1.5(CLK) ; port SDcard-CK
SDcard-CS: S1.2(CD/Data3) ; port SDcard-CS
SDcard-DI: R124.1 S1.3(CMD) ; port SDcard-DI
SDcard-DO: R123.1 S1.7(Data0) ; port SDcard-DO
VAenable: U26.3(Enable) ; port VAenable

Not connected (* = marked no-connect by the designer): S1 1(Data2) 8(Data1); U26 4(NC)

### Notes on the sheet
- Date:
- Project
- Part
- Revision:
- File :
- Page
- de

### Library data of the parts
C40 C72 = 4.7uF[[/\]]0603[[/\]]1: Capacitor; Manufacturer: Kemet; Manufacturer Nr: C0603C475K9PAC; Preference: 1; Tolerance +: +10; Tolerance -: -10; Dielectric: X5R; Voltage: 6.3; MaxTemperature: +85; MinTemperature: -55; Quant_1: 10; Quant_2: 100; Quant_3: 1000; Quant_4: 4000; Currentie: CHF; LayerSch: Top; Size: 0603; Footprint Acort: 0603_G; Supplier: Farnell; Supplier Nr: 9227784; ComponentLink2Description: Farnell link; ComponentLink2URL: http://ch.farnell.com/jsp/displayProduct.jsp?sku=9227784; Price_1: 0.33; Price_2: 0.298; Price_3: 0.278; Price_4: 0.246; ROHS: True; DateLastUpdate: 2007-12-03 / 14:22:57
C55 = 100nF[[/\]]0603[[/\]]1: Capacitor; Manufacturer: Kemet; Manufacturer Nr: C0603C104K5RAC; Preference: 1; Tolerance +: +10; Tolerance -: -10; Dielectric: X7R; Voltage: 50; MaxTemperature: +125; MinTemperature: -55; Quant_1: 10; Quant_2: 100; Quant_3: 1000; Quant_4: 4000; Currentie: CHF; Size: 0603; Footprint Acort: 0603_G; Supplier: Farnell; Supplier Nr: 1288255; ComponentLink2Description: Farnell link; ComponentLink2URL: http://ch.farnell.com/jsp/displayProduct.jsp?sku=1288255; Price_1: 0.046; Price_2: 0.04; Price_3: 0.037; Price_4: 0.036; ROHS: True; DateLastUpdate: 2007-12-03 / 14:22:31
C63 = 1uF[[/\]]0603[[/\]]1: Capacitor; Manufacturer: Murata; Manufacturer Nr: GRM188R61E105K; Preference: 1; Tolerance +: +10; Tolerance -: -10; Dielectric: X5R; Voltage: 25; MaxTemperature: +85; MinTemperature: -55; Quant_1: 10; Quant_2: 100; Quant_3: 500; Currentie: CHF; Size: 0603; Footprint Acort: 0603_G; Supplier: Distrelec; Supplier Nr: 823495; ComponentLink2Description: Distrelec link; ComponentLink2URL: http://www.distrelec.com/ishopWebFront/search/luceneSearch.do?dispatch=find&showImage=on&artnrPhrase=823495; Price_1: 0.1797; Price_2: 0.1474; Price_3: 0.1162; ROHS: True; DateLastUpdate: 2007-12-03 / 14:22:46
R123 R124 = 100K[[/\]]0603[[/\]]1: Resistor; Manufacturer: Vishay; Manufacturer Nr: D11CRCW06030B1003F; Tolerance: +/-1; Preference: 1; Power: 0.1; Voltage: 75; Current: 1.5; ppm/K: +/-100; Quant_1: 10; Quant_2: 100; Quant_3: 500; Currentie: CHF; Size: 0603; Footprint Acort: 0603; ComponentLink1Description: OnLine datasheet; Supplier: Distrelec; Supplier Nr: 715636; ComponentLink2Description: Distrelec link; ComponentLink2URL: http://www.distrelec.com/ishopWebFront/search/luceneSearch.do?dispatch=find&showImage=on&artnrPhrase=715636; ROHS: True; Price_1: 0.0538; Price_2: 0.0323; Price_3: 0.0204; DateLastUpdate: 2007-12-03 / 16:29:58
S1 = SD-Card-Micro-ASLTRON 5190008-XA4-R: MicroSD Card connector 5190008-XA4-R; LayerSch: Top
U26 = AP7331: 300mA, Low Quiescent Current, Fast Transient LDO; LayerSch: Top

## Nets that join several sheets
AGND: microcontroleur (C43.2 U20.2), IR-sensors (34 pins), USB-power (C4.1 C50.2 U24.2 XS1.2), accelerometer (6 pins), sound (5 pins)
GND: microcontroleur (19 pins), IR-sensors (24 pins), USB-power (23 pins), accelerometer (C3.2), LEDs (51 pins), motor (18 pins), sound (C59.1 C60.2 C61.2 U25.7), SDcard (7 pins)
VA: microcontroleur (R105.2), IR-sensors (20 pins), USB-power (C50.1 U24.5), accelerometer (C1.1 C2.1 U1.9), sound (C65.1 R126.2 R128.2 U5.4)
VBat: microcontroleur (P1.1), IR-sensors (15 pins), USB-power (8 pins), LEDs (C31.1 D8.2 D37.2 U18.1), motor (12 pins), sound (C61.1 U25.6), SDcard (C40.1 U26.1)
VCC: microcontroleur (L5.1 R103.2 R104.2 X1.2), USB-power (C48.1 U22.5), accelerometer (C3.1 U1.2 U1.3 U1.10), LEDs (21 pins), motor (D33.2 D34.2)
ACC_INT: microcontroleur (U19.55), accelerometer (U1.12)
D_N: microcontroleur (U19.36), USB-power (U23.2 X3.2)
D_P: microcontroleur (U19.37), USB-power (U23.3 X3.3)
IR-pulse-back: microcontroleur (U19.31), IR-sensors (R52.1 R53.1)
IR-pulse-front: microcontroleur (U19.43), IR-sensors (5 pins)
IR-pulse-groundL: microcontroleur (U19.54), IR-sensors (R1.1)
IR-pulse-groundR: microcontroleur (U19.64), IR-sensors (R2.1)
IR-sens-backL: microcontroleur (U19.44), IR-sensors (R42.1 U5.7)
IR-sens-backR: microcontroleur (U19.48), IR-sensors (R43.1 U5.8)
IR-sens-front1: microcontroleur (U19.18), IR-sensors (R7.1 U4.1)
IR-sens-front2: microcontroleur (U19.8), IR-sensors (R8.1 U4.7)
IR-sens-front3: microcontroleur (U19.21), IR-sensors (R9.1 U4.8)
IR-sens-front4: microcontroleur (U19.6), IR-sensors (R10.1 U4.14)
IR-sens-front5: microcontroleur (U19.22), IR-sensors (R11.1 U5.1)
IR-sens-groundL: microcontroleur (U19.17), IR-sensors (R4.2 U2.3)
IR-sens-groundR: microcontroleur (U19.11), IR-sensors (R6.2 U3.3)
LED_CLK: microcontroleur (U19.46), LEDs (5 pins)
LED_CS: microcontroleur (U19.47), LEDs (5 pins)
LED_SDI: microcontroleur (U19.45), LEDs (U14.14)
Micro: microcontroleur (U19.23), sound (C64.2 R125.2 U5.14)
MOTOR1-PWMH1: microcontroleur (U19.63), motor (R111.1 T2.1)
MOTOR1-PWMH2: microcontroleur (U19.1), motor (R113.1 T1.1)
MOTOR1-PWML1: microcontroleur (U19.32), motor (R121.1 R152.1)
MOTOR1-PWML2: microcontroleur (U19.42), motor (R119.1 R151.2)
MOTOR1-SENS: microcontroleur (U19.27), motor (C53.1 D33.3 R115.1 R117.2)
MOTOR2-PWMH1: microcontroleur (U19.60), motor (R112.1 T4.1)
MOTOR2-PWMH2: microcontroleur (U19.61), motor (R114.1 T3.1)
MOTOR2-PWML1: microcontroleur (U19.52), motor (R122.1 R153.1)
MOTOR2-PWML2: microcontroleur (U19.53), motor (R120.1 R154.1)
MOTOR2-SENS: microcontroleur (U19.24), motor (C54.1 D34.3 R116.1 R118.2)
SCL: microcontroleur (P1.2 R103.1 U19.2), accelerometer (U1.1)
SDA: microcontroleur (P1.3 R104.1 U19.3), accelerometer (U1.4)
SDcard-CK: microcontroleur (U19.49), SDcard (S1.5)
SDcard-CS: microcontroleur (U19.29), SDcard (S1.2)
SDcard-DI: microcontroleur (U19.50), SDcard (R124.1 S1.3)
SDcard-DO: microcontroleur (U19.51), SDcard (R123.1 S1.7)
SOUND_ON: LEDs (R159.2 U13.7), sound (U25.1)
SOUND_OUT: microcontroleur (U19.30), sound (R131.1)
USB-500: microcontroleur (U19.58), USB-power (R138.2 U21.4)
USB-Charge: microcontroleur (U19.59), USB-power (R139.1 U21.17)
USB-Present: microcontroleur (U19.34), USB-power (U23.5)
VAenable: microcontroleur (U19.62), USB-power (R136.2 U24.3), LEDs (U18.3), SDcard (U26.3)

## Assembly variants
Production Thymio2: not fitted P1 R162 R163 R164 R165 R172 R173 X1
Production Thymio2_for_testing: not fitted P1 R162 R163 R164 R165 R170 R171 X1
EMS-Proto: not fitted BT1 D7 D8 D9 D10 D11 D12 D17 D18 D19 D20 D25 D26 D31 D32 D35 D36 D37 LS1 MC1 P1 U2 U3 U6 U7 U8 U9 U10 U11 U12 U20 X1 X2
Test point variant: not fitted MC1 P1 S2 U20 U21 X3